# Altium schematic sheet ATSAMD10-XMINI_Programmer.SchDoc: ATSAMD10-XMINI
size A3; Organization: ATMEL Norway; Address1: Vestre Rosten 79; Address2: N-7075 TILLER; Address3: NORWAY; DocumentNumber: A09-2378; Revision: 2; SheetNumber: 3; SheetTotal: 3; PageSetup: Record=PageOptions|CenterHorizontal=True|CenterVertical=True|PrintScale=1.01|XCorrection=1.00|YCorrection=1.00|PrintKind=1|BorderSize=5000000|LeftOffset=0|BottomOffset=0|Orientation=2|PaperLength=1000|PaperWidth=1000|Scale=100|PaperSource=7|PrintQuality=-4|MediaType=1|DitherType=10|PaperKind=A3 (297 x 420 mm)|PrintScaleMode=1
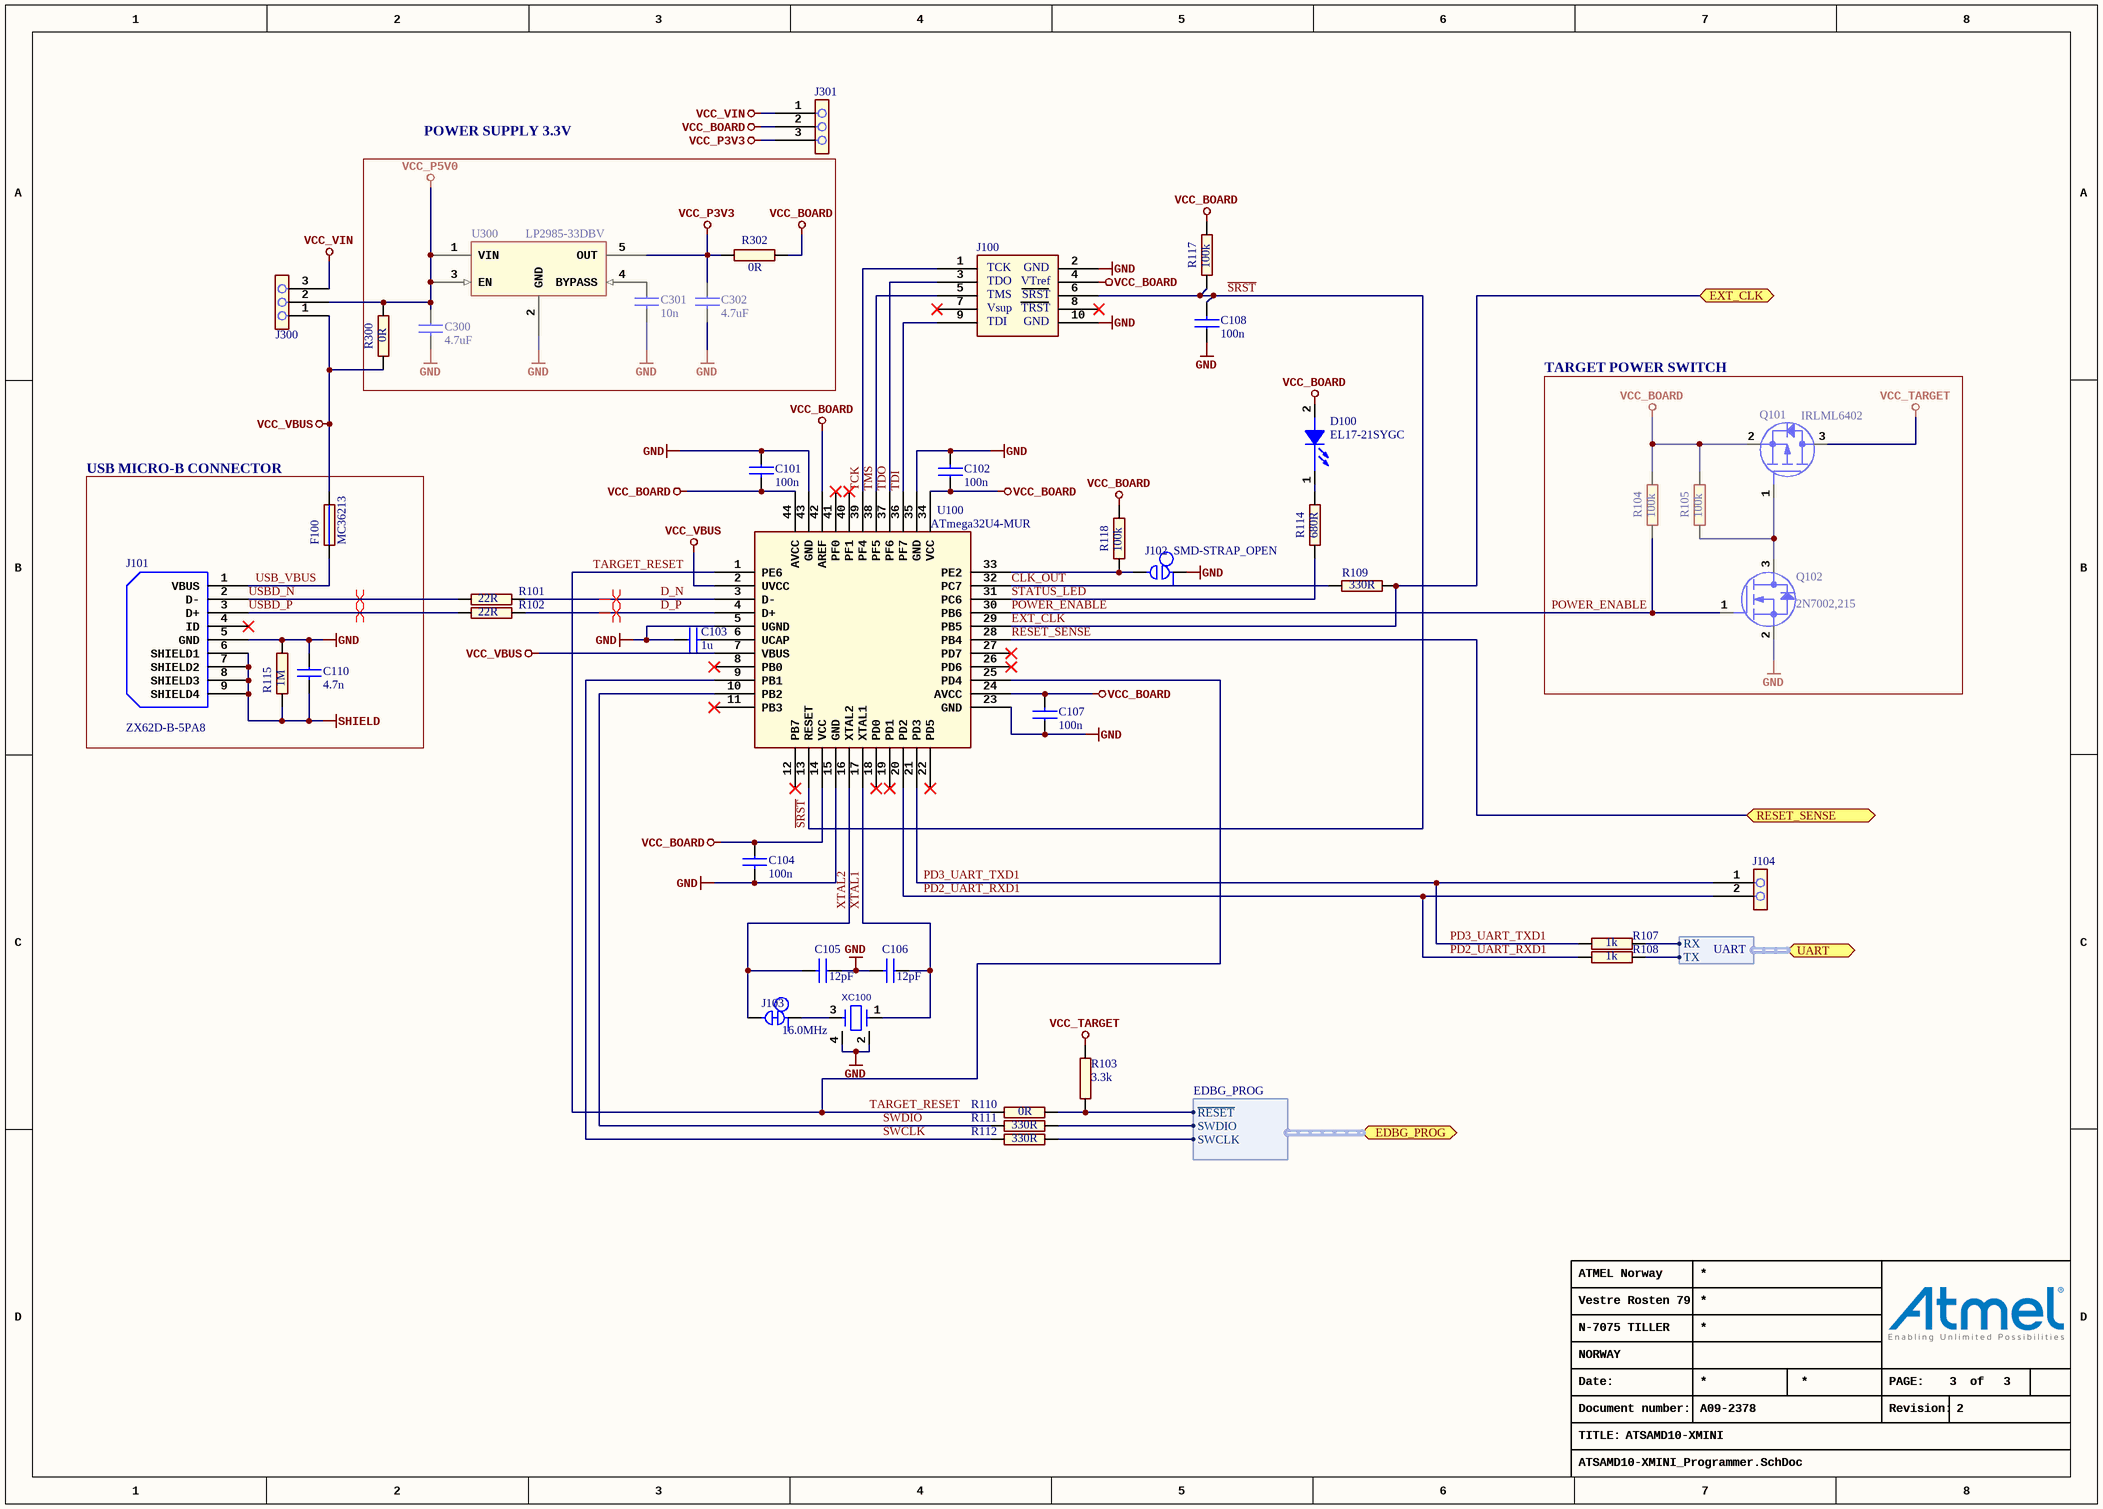
[diagram p0: ATSAMD10-XMINI_Programmer.SchDoc]

## Parts
C101  value 100n  [AP1-00001]
C102  value 100n  [AP1-00001]
C103  value 1u  [AP1-00001]
C104  value 100n  [AP1-00001]
C105  value 12pF  [AP1-00038]
C106  value 12pF  [AP1-00038]
C107  value 100n  [AP1-00001]
C108  value 100n  [AP1-00001]
C110  value 4.7n  [AP1-00001]
C300  value 4.7uF  [AP1-00002]  (hidden comment: Farnell no.: 1833806)
C301  value 10n  [AP1-00001]
C302  value 4.7uF  [AP1-00002]  (hidden comment: Farnell no.: 1833806)
D100  value EL17-21SYGC  [AP4-00013]
F100  value MC36213  [AP2-00002]  (hidden comment: Farnell no: 1861197)
J100  (no value)  [AP8-00257]
J101  value ZX62D-B-5PA8  [AP8-00851]  (hidden comment: 2,000 pieces per reel)
J102  value SMD-STRAP_OPEN  [AP9-00034]  (net tie, no BOM)
J103  (no value)  [AP9-00044]  (net tie, no BOM)
J104  (no value)  [AP8-00733]
J300  (no value)  [AP8-00745]
J301  (no value)  [AP8-00745]
Q101  value IRLML6402  [AP5-00002]
Q102  value 2N7002,215  [AP5-00002]
R101  value 22R  [AP2-00000]
R102  value 22R  [AP2-00000]
R103  value 3.3k  [AP2-00000]
R104  value 100k  [AP2-00000]
R105  value 100k  [AP2-00000]
R107  value 1k  [AP2-00000]
R108  value 1k  [AP2-00000]
R109  value 330R  [AP2-00000]
R110  value 0R  [AP2-00000]
R111  value 330R  [AP2-00000]
R112  value 330R  [AP2-00000]
R114  value 680R  [AP2-00000]
R115  value 1M  [AP2-00000]
R117  value 100k  [AP2-00000]
R118  value 100k  [AP2-00000]
R300  value 0R  [AP2-00000]
R302  value 0R  [AP2-00000]
U100  value ATmega32U4-MUR  [AP6-00375]
U300  value LP2985-33DBV  [AP6-00087]
XC100  value 16.0MHz  [AP7-00061]

## Blocks framed on the sheet
POWER SUPPLY 3.3V: C300-C302 R300 R302 U300
TARGET POWER SWITCH: Q101 Q102 R104 R105
USB MICRO-B CONNECTOR: C110 F100 J101 R115

## Ports
EDBG_PROG (harness EDBG_PROG), EXT_CLK (bidir), RESET_SENSE, UART (harness UART)

## Harnesses
UART: RX, TX
EDBG_PROG: ~{RESET}, SWDIO, SWCLK

## Nets
GND: C101.1 C102.2 C103.1 C104.2 C105.1 C106.2 C107.1 C108.1 C110.1 C300.2 C301.2 C302.2 J100.2 J100.10 J101.5(GND) J102.1 Q102.2(S) R115.2 U100.5(UGND) U100.15(GND) U100.23(GND) U100.35(GND) U100.43(GND) U100.45(GND) U300.2(GND) XC100.2(GND) XC100.4(GND)
SHIELD: C110.2 J101.6(SHIELD1) J101.7(SHIELD2) J101.8(SHIELD3) J101.9(SHIELD4) R115.1
VCC_BOARD: C101.2 C102.1 C104.1 C107.2 D100.2(ANODE) J100.4 J301.2 Q101.2(S) R104.2 R105.2 R117.2 R118.2 R302.2 U100.14(VCC) U100.24(AVCC) U100.34(VCC) U100.42(AREF) U100.44(AVCC)
VCC_P3V3: C302.1 J301.3 R302.1 U300.5(OUT)
VCC_P5V0: C300.1 J300.2 R300.2 U300.1(VIN) U300.3(EN)
VCC_TARGET: Q101.3(D) R103.2
VCC_VBUS: F100.2 J300.1 R300.1 U100.2(UVCC) U100.7(VBUS)
VCC_VIN: J300.3 J301.1
CLK_OUT: R109.2 U100.32(PC7)
D_N: R101.2 U100.3(D-)
D_P: R102.2 U100.4(D+)
EXT_CLK: R109.1 U100.29(PB5) ; port EXT_CLK
PD2_UART_RXD1: J104.2 R108.1 U100.20(PD2)
PD3_UART_TXD1: J104.1 R107.1 U100.21(PD3)
POWER_ENABLE: Q102.1(G) R104.1 U100.30(PB6)
RESET_SENSE: U100.28(PB4) ; port RESET_SENSE
~{SRST}: C108.2 J100.6 R117.1 U100.13(RESET)
STATUS_LED: R114.2 U100.31(PC6)
SWCLK: R112.1 U100.9(PB1)
SWDIO: R111.1 U100.10(PB2)
TARGET_RESET: R110.1 U100.1(PE6) U100.25(PD4)
TCK: J100.1 U100.39(PF4)
TDI: J100.9 U100.36(PF7)
TDO: J100.3 U100.37(PF6)
TMS: J100.5 U100.38(PF5)
USB_VBUS: F100.1 J101.1(VBUS)
USBD_N: J101.2(D-) R101.1
USBD_P: J101.3(D+) R102.1
XTAL1: C106.1 U100.17(XTAL1) XC100.1(IN)
XTAL2: C105.2 J103.2 U100.16(XTAL2)
NetC103_2: C103.2 U100.6(UCAP)
NetC301_1: C301.1 U300.4(BYPASS)
NetD100_1: D100.1(CATHODE) R114.1
NetJ102_2: J102.2 R118.1 U100.33(PE2)
NetJ103_1: J103.1 XC100.3(OUT)
NetQ101_1: Q101.1(G) Q102.3(D) R105.1
NetR103_1: R103.1 R110.2 ; port EDBG_PROG.~{RESET}
NetR107_2: R107.2 ; port UART.RX
NetR108_2: R108.2 ; port UART.TX
NetR111_2: R111.2 ; port EDBG_PROG.SWDIO
NetR112_2: R112.2 ; port EDBG_PROG.SWCLK

Not connected (* = marked no-connect by the designer): J100 7* 8*; J101 4(ID)*; U100 8(PB0)* 11(PB3)* 12(PB7)* 18(PD0)* 19(PD1)* 22(PD5)* 26(PD6)* 27(PD7)* 40(PF1)* 41(PF0)*

## Layout directives
differential pair: D_N, D_P, USBD_N, USBD_P

## Notes on the sheet
- Date:
- PAGE:
- of
- TITLE:
- Document number:
- Revision:
- (in symbol A08-0385) TCK; GND; TDO; VTref; TMS; SRST; Vsup; TRST; TDI

## Library data of the parts
C101 C102 C104 C107 C108 = A01-0246: Ceramic capacitor, SMD 0402, X7R, 16V, +/-10%; PartGroup: Capacitors,Ceramic,SMD 0402; Manufacturer: Kemet; MPN: C0402C104K4RACTU; TemperatureRange: -55 - +125 deg C; AN: A01-0246; Tolerance: 16V, +/-10%; Height: 0,5
C103 = A01-0286: Ceramic capacitor, SMD 0402, X5R, 6.3V, +/-10% (de26942); PartGroup: Capacitors,Ceramic,SMD 0402; Manufacturer: Kemet; MPN: C0402C105K9PAC; TemperatureRange: -55 to 85 deg C; AN: A01-0286; Tolerance: +/-10%; Height: 0,5
C105 C106 = A01-0355: Ceramic capacitor, SMD 0402, NP0, 50V, +/-5% (de19819); PartGroup: Capacitors,Ceramic,SMD 0402; Manufacturer: Kyocera-elco; MPN: CM05CG120J50AH; Tolerance: 5%; TemperatureRange: -55 - +125 deg C; AN: A01-0355
C110 = A01-0046: Ceramic capacitor, SMD 0402, X7R, 25V, +/-10% (de35287); PartGroup: Capacitors,Ceramic,SMD 0402; Manufacturer: PHYCOMP; MPN: 2238 587 15632; TemperatureRange: -55 - +125 deg C; AN: A01-0046; Tolerance: 25V, +/-10%; Height: 0,550000011920929
C300 C302 = A01-0502: Ceramic capacitor, SMD 0603, X5R, 10V, ±10 %; PartGroup: Capacitors,Ceramic,SMD 0603; Manufacturer: AVX; MPN: 0603ZD475KAT2A; Tolerance: Â±10%; TemperatureRange: Ã‚â€“55 to +85 deg C; AN: A01-0502; Height: 0,899999976158142
C301 = A01-0050: Ceramic capacitor, SMD 0402, X7R, 25V, +/-10%; PartGroup: Capacitors,Ceramic,SMD 0402; Manufacturer: YAGEO CORP; MPN: CC0402KRX7R8BB103; TemperatureRange: -55 - +125 deg C; AN: A01-0050; Tolerance: 25V, +/-10%; Height: 0,550000011920929
D100 = A10-0018: LED, Green, Wave length=575nm, SMD 0805, ±70°; PartGroup: Opto,LEDs,SMD; Manufacturer: Everlight; TemperatureRange: -40 - +85 deg C; AN: A10-0018; Height: 1,10000002384186; MPN: EL17-21SYGC
F100 = A02-0622: Resetable PTC fuse, Ih = 0.5A, It = 1.0A, 0805 package; PartGroup: Resistors,Resettable fuses,SMD; Manufacturer: Multicomp; TemperatureRange: -40°C to + 85°C; AN: A02-0622; Height: 1,25; MPN: MC36213
J100 = A08-0385: 2x5 pin header, 1.27mm pitch, THM; PartGroup: Mechanical devices,Connectors,Pin headers; Manufacturer: Garry; MPN: 176-2-010-0-T-XS0-0730; Value: PIN HEADER 2x5; AN: A08-0385; Height: 7,30000019073486
J101 = A08-2092: Micro USB B Connector, Standard SMT + DIP; PartGroup: Mechanical devices,Connectors,USB; Manufacturer: HIROSE; MPN: ZX62D-B-5PA8(30); AN: A08-2092; Height: 2,79999995231628
J102 = A09-0483: Default open SMD strap; PartGroup: Mechanical devices,PCB implemented components; AN: A09-0483
J103 = A09-0783: Default closed SMD strap, 0603 size; PartGroup: Mechanical devices,PCB implemented components; Value: SMD-STRAP_0603_CLOSED; AN: A09-0783; Height: 0
J104 = A08-1754: 1x2 pin header, 2.54mm pitch, Pin-in-Paste THM; PartGroup: Mechanical devices,Connectors,Pin headers; Manufacturer: SAMTEC; Value: HMTSW-102-23-F-S-237; TemperatureRange: - 55 deg C to + 125 deg C; AN: A08-1754; Height: 6,09999990463257; MPN: HMTSW-102-23-F-S-237
J300 J301 = A08-1799: 1x3 pin header, 2.54mm pitch, Pin-in-Paste THM, 1mm hole; PartGroup: Mechanical devices,Connectors,Pin headers; Manufacturer: SAMTEC; Value: HMTSW-103-23-F-S-237; AN: A08-1799; Height: 6,09999990463257; MPN: HMTSW-103-23-F-S-237
Q101 = A05-0087: P-ch. MOSFET. -30V, -3.7A continuous,RDS(ON)=0.05Ohm@VGS=-4,5V, RDS(ON)=0.08Ohm@VGS=-2.5V; PartGroup: Transistors,Power FET,SMD; Manufacturer: International Rectifier; MPN: IRLML6402PBF; TemperatureRange: -55 - +150 deg C; AN: A05-0087; Height: 1,14999997615814
Q102 = A05-0085: N-Channel MOSFET. 60V, 0.300A continuous, 1.2A Peak. RDS(ON) = 3.8Ohm@VGS=4.5V, VGS(th)<2.5V; PartGroup: Transistors,Small signal FET,SMD; Manufacturer: NXP; TemperatureRange: -65 to 150 deg C; AN: A05-0085; Height: 1,10000002384186; MPN: 2N7002,215
R101 R102 = A02-0172: Thick film resistor, SMD 0402, 1/16W, 1% (de23607); PartGroup: Resistors,SMD,0402 1%; Manufacturer: Samsung; MPN: RC100SF22R0CS; TemperatureRange: -55 - +125 deg C; AN: A02-0172; Tolerance: 1 %; Height: 0,349999994039536
R103 = A02-0224: Thick film resistor, SMD 0402, 1/16W, 1%; PartGroup: Resistors,SMD,0402 1%; Manufacturer: ASJ; MPN: CR10-3301-FK; TemperatureRange: -55 - +125 deg C; AN: A02-0224; Tolerance: 1 %; Height: 0,349999994039536
R104 R105 R117 R118 = A02-0260: Thick film resistor, SMD 0402, 1/16W, 1%; PartGroup: Resistors,SMD,0402 1%; Manufacturer: ASJ; MPN: CR10-1003-FK; TemperatureRange: -55ï¿½ to +125ï¿½C; AN: A02-0260; Tolerance: 1 %; Height: 0,349999994039536
R107 R108 = A02-0212: Thick film resistor, SMD 0402, 1/16W, 1%; PartGroup: Resistors,SMD,0402 1%; Manufacturer: ASJ; MPN: CR10-1001-FK; TemperatureRange: -55 - +125 deg C; AN: A02-0212; Tolerance: 1 %; Height: 0,349999994039536
R109 R111 R112 = A02-0200: Thick film resistor, SMD 0402, 1/16W, 1%; PartGroup: Resistors,SMD,0402 1%; Manufacturer: ASJ; MPN: CR10-3300-FK; TemperatureRange: -55 - +125 deg C; AN: A02-0200; Tolerance: 1 %; Height: 0,349999994039536
R110 R300 R302 = A02-0163: RES 0.0 OHM 1/16W 0402 SMD; PartGroup: Resistors,SMD,0402 1%; Manufacturer: (n/a); MPN: RMCF0402ZT0R00; Tolerance: 1 %; TemperatureRange: -55 - +125 deg C; AN: A02-0163; Height: 0,349999994039536
R114 = A02-0208: Thick film resistor, SMD 0402, 1/16W, 1%; PartGroup: Resistors,SMD,0402 1%; Manufacturer: ASJ; MPN: CR10-6800-FK; TemperatureRange: -55 - +125 deg C; AN: A02-0208; Tolerance: 1 %; Height: 0,349999994039536
R115 = A02-0284: Thick film resistor, SMD 0402, 1/16W, 1%; PartGroup: Resistors,SMD,0402 1%; Manufacturer: ASJ; MPN: CR10-1004-FK; TemperatureRange: -55 - +125 deg C; AN: A02-0284; Tolerance: 1 %; Height: 0,349999994039536
U100 = A06-0305: ATmega32U4 QFN package; PartGroup: Integrated Circuits,MCU, MPU, DSP,AVR MCU; Manufacturer: ATMEL; AN: A06-0305; Height: 1; MPN: ATmega32U4-MUR
U300 = A06-1099: LDO 3.3V 150mA SOT23-5 1.5% (cer. cap); PartGroup: Integrated Circuits,Regulators,Linear; Manufacturer: Texas Instruments; TemperatureRange: -40 - +125 deg. C; AN: A06-1099; Tolerance: 1.5%; Height: 1,10000002384186; MPN: LP2985-33DBV
XC100 = A07-0078: 16MHz uXtal, 3.2 x 2.5 mm SMD, CL=9pF, 15PPM, ESR=80ohm(Max.; PartGroup: Frequency devices,Crystals,SMD; Manufacturer: Epson Toyocom; MPN: TSX-3225 16.0000MF09Z-AC3; TemperatureRange: -40Â°C to +85Â°C; AN: A07-0078; Tolerance: 15ppm; Height: 0,699999988079071